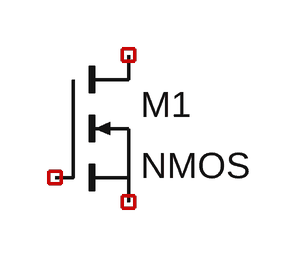
[diagram p0: schematic Draft1.asc]
Draft1.asc, the LTspice schematic file:
Version 4.1
SHEET 1 880 680
SYMBOL nmos 80 0 R0
SYMATTR InstName M1

The netlist it stands for:
* Draft1.asc
M1 NC_01 NC_02 NC_03 NC_03 NMOS
.model NMOS NMOS
.model PMOS PMOS
.lib standard.mos
.backanno
.end